# EasyEDA Pro project ProPrj_acoustic imager_2026-03-04.epro

# Schematic Schematic1
Board Name: Board1; Create Date: 2026-03-03; Page Name: P1; Project Name: acoustic imager; Schematic Name: Schematic1; Update Date: 2026-03-03; Company: EasyEDA.com; Page Size: A4; Version: V1.0
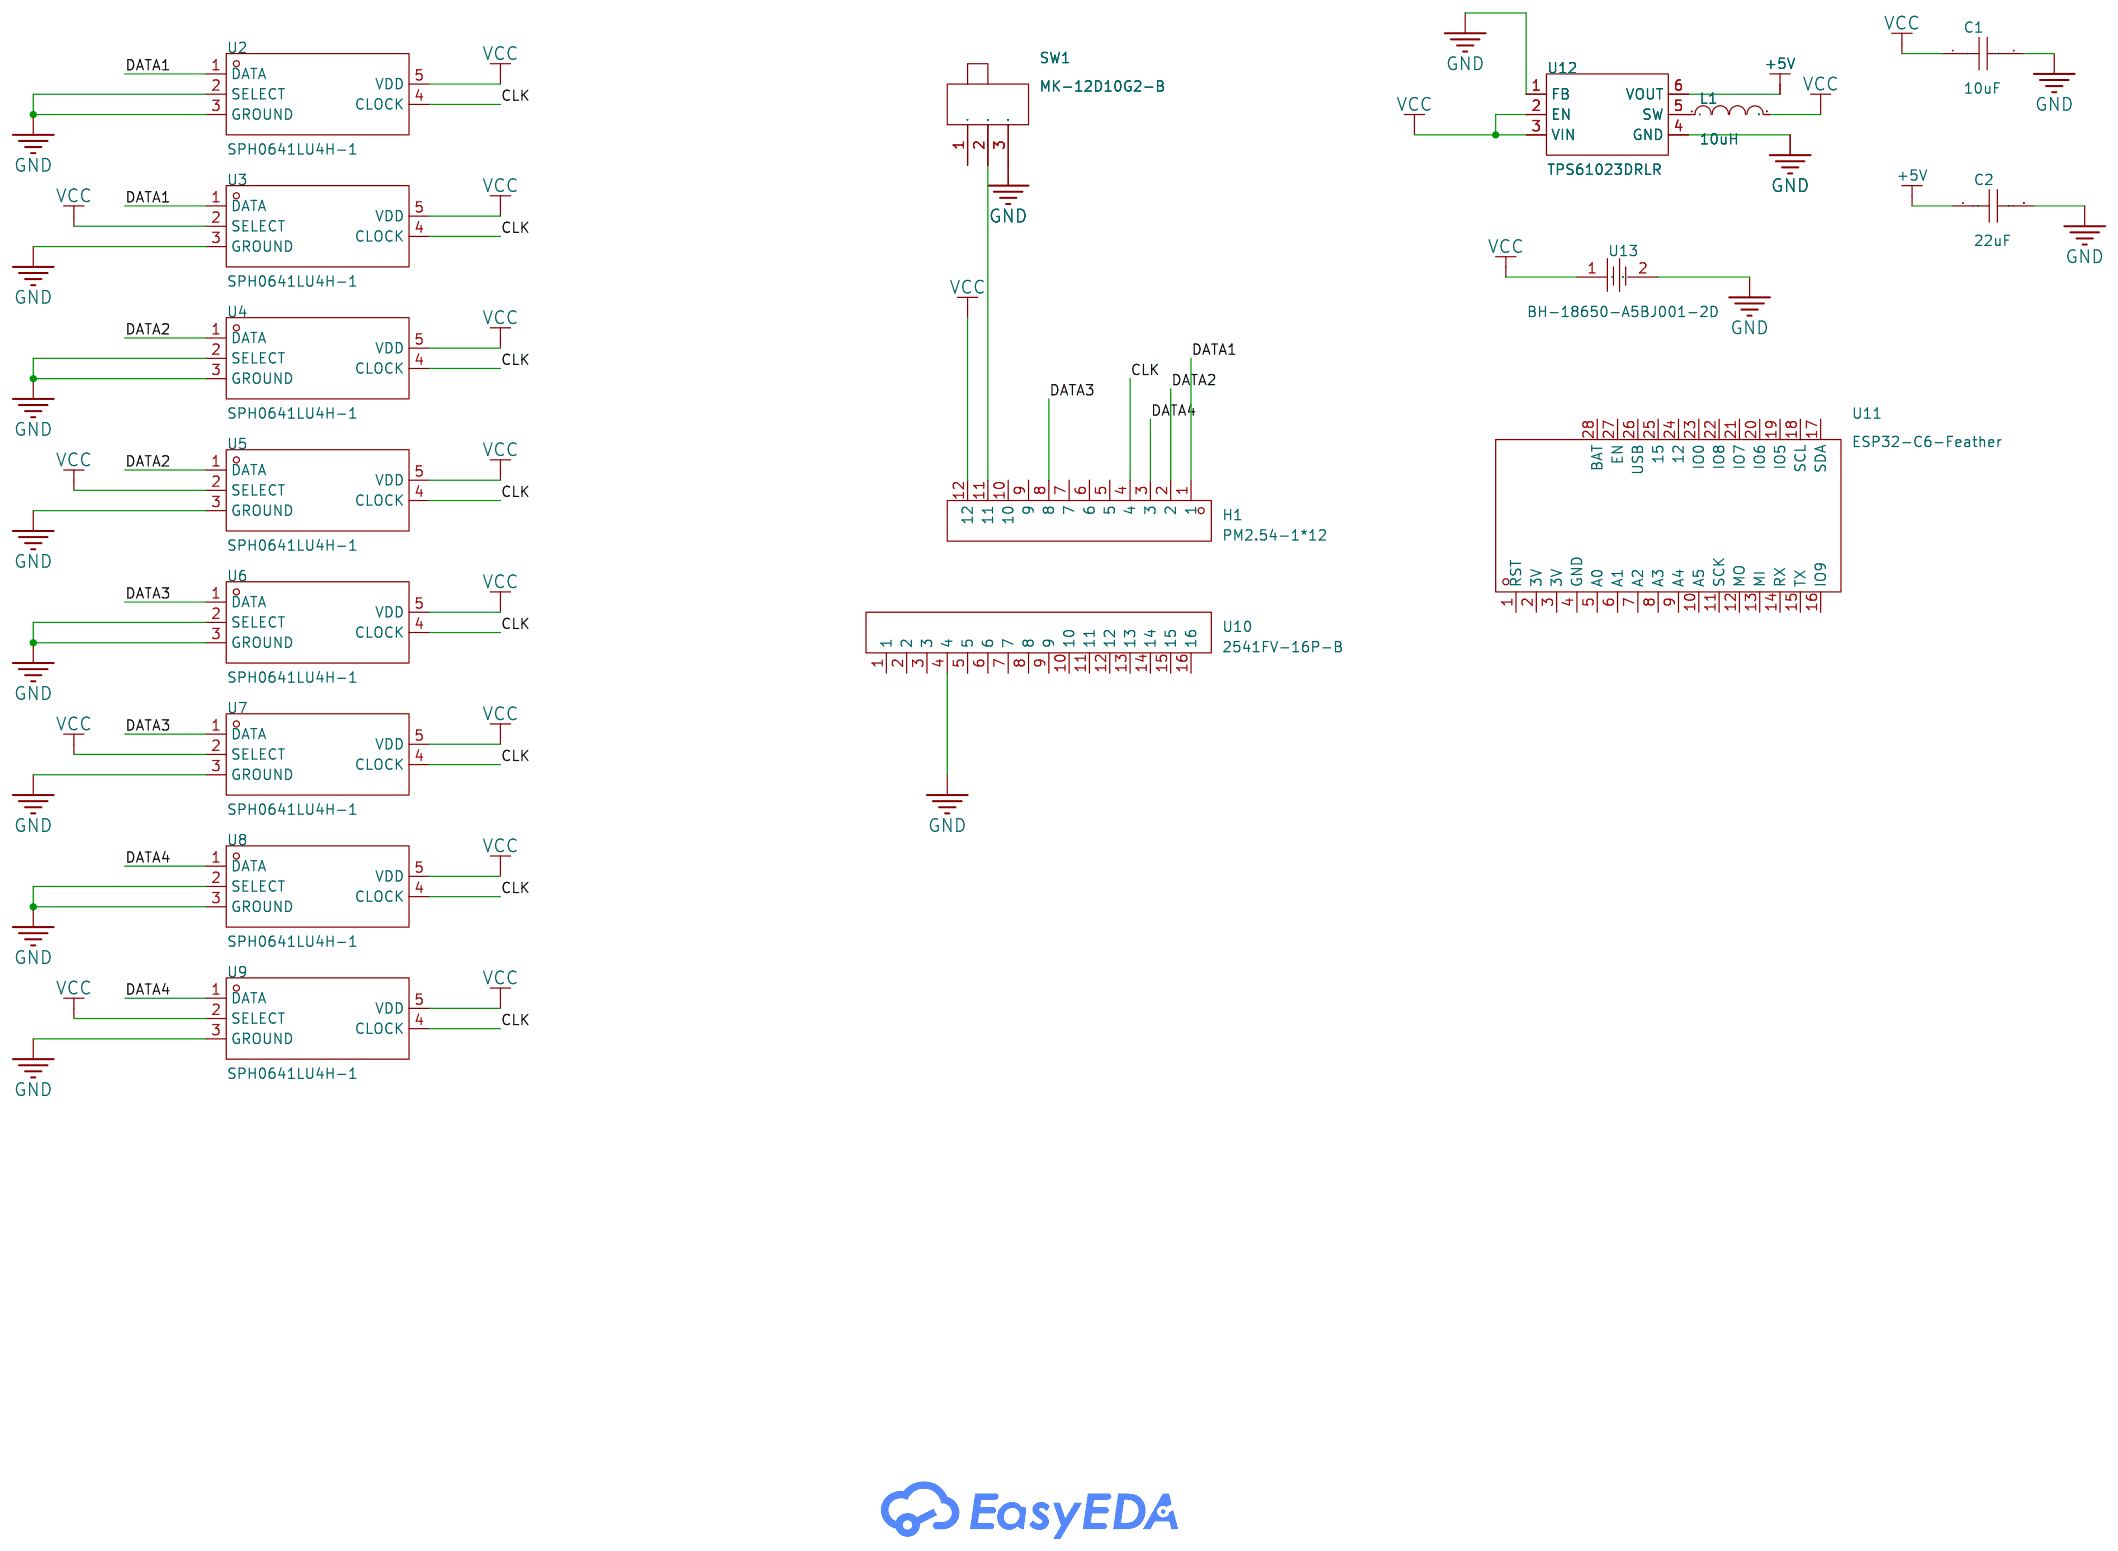
[diagram p0: schematic sheet]

## Parts
C1  10uF  [C0805]
C2  22uF  [C0805]
H1  PM2.54-1*12  [HDR-TH_12P-P2.54-V-F]
L1  10uH  [L0805]
SW1  MK-12D10G2-B  [SW-TH_MK-12D10G2-B]
U2  SPH0641LU4H-1  [MIC-SMD_5P_L3.5-W2.7-P0.82_SPH0641LU4H-1]
U3  SPH0641LU4H-1  [MIC-SMD_5P_L3.5-W2.7-P0.82_SPH0641LU4H-1]
U4  SPH0641LU4H-1  [MIC-SMD_5P_L3.5-W2.7-P0.82_SPH0641LU4H-1]
U5  SPH0641LU4H-1  [MIC-SMD_5P_L3.5-W2.7-P0.82_SPH0641LU4H-1]
U6  SPH0641LU4H-1  [MIC-SMD_5P_L3.5-W2.7-P0.82_SPH0641LU4H-1]
U7  SPH0641LU4H-1  [MIC-SMD_5P_L3.5-W2.7-P0.82_SPH0641LU4H-1]
U8  SPH0641LU4H-1  [MIC-SMD_5P_L3.5-W2.7-P0.82_SPH0641LU4H-1]
U9  SPH0641LU4H-1  [MIC-SMD_5P_L3.5-W2.7-P0.82_SPH0641LU4H-1]
U10  2541FV-16P-B  [HDR-TH_16P-P2.54-V-F-4]
U11  ESP32-C6-Feather  [COMM-TH_L50.8-W22.9-P2.54-LS20.32]
U12  TPS61023DRLR  [SOT-563_L1.6-W1.2-P0.50-LS1.6-BR]
U13  BH-18650-A5BJ001-2D  [BAT-TH_BH-18650-A5BJ001-2D]

## Library data of the parts
C1 = GRM21BR61H106KE43L: Capacitance:10uF Tolerance:±10% Tolerance:±10% Voltage Rating:50V Temperature Coefficient:X5R; LCSC Part Name: 10uF ±10% 50V; Supplier Part: C440198; Manufacturer: muRata(村田); Supplier Footprint: 0805; JLCPCB Part Class: Basic Part; Datasheet: https://item.szlcsc.com/datasheet/GRM21BR61H106KE43L/439567.html; Supplier: LCSC; Tolerance: ±10%; Voltage Rating: 50V; Temperature Coefficient: X5R
C2 = GRM21BZ71A226ME15K: Capacitance:22uF Tolerance:±20% Tolerance:±20% Voltage Rating:10V Temperature Coefficient:X7R; LCSC Part Name: 22uF ±20% 10V; Supplier Part: C22269426; Manufacturer: muRata(村田); Datasheet: https://item.szlcsc.com/datasheet/GRM21BZ71A226ME15K/23701406.html; Supplier: LCSC; Tolerance: ±20%; Voltage Rating: 10V; Temperature Coefficient: X7R
H1 = PM2.54-1*12: Holes Structure:1x12P Pitch:2.54mm Row Spacing:2.54mm Circular Hole / Square Hole:Square Hole Mounting Type:Through Hole Number of Rows:1 Number of Positions:12P Current Rating:2.5A Holes Direction:Top Insulation Height:8.5mm Operating Temperature:-40℃~+1; LCSC Part Name: 间距:2.54mm 1x12P 直插; Supplier Part: C5224029; Manufacturer: ZHOURI(洲日); Supplier Footprint: 插件,P=2.54mm; JLCPCB Part Class: Extended Part; Datasheet: https://item.szlcsc.com/datasheet/PM2.54-1*12/5925208.html; Supplier: LCSC; Holes Structure: 1x12P; Pitch: 2.54mm; Row Spacing: 2.54mm; Circular Hole / Square Hole: Square Hole; Mounting Type: Through Hole; Number of Rows: 1; Number of Positions: 12P; Current Rating: 2.5A; Holes Direction: Top; Insulation Height: 8.5mm; Operating Temperature: -40℃~+105℃
L1 = SDFL2012S100KTF: Inductance: Tolerance:±10% Tolerance:±10% Rated Current: Current - Saturation (Isat):- DC Resistance(DCR): Q @ Frequency:- Frequency - Self Resonant:- Ratings:; LCSC Part Name: 10uH ±10%; Supplier Part: C1046; Manufacturer: Sunlord(顺络); Supplier Footprint: 0805; JLCPCB Part Class: Basic Part; Datasheet: https://atta.szlcsc.com/upload/public/pdf/source/20231027/097A17DDB71564CE812E62F0F80142C9.pdf; Supplier: LCSC; Tolerance: ±10%
SW1 = MK-12D10G2-B: Circuit:SPDT Actuator Style:Rectangular Columnar Termination Style:PC Pin Length:9mm Width:3.5mm Mounting Type:Right Angle Current Rating:300mA Voltage Rating:12V Life:10,000 Cycles; LCSC Part Name: mini拨动开关; Supplier Part: C20611665; Manufacturer: HOOYA(皓宇电子); Supplier Footprint: 插件,9x3.5mm; JLCPCB Part Class: Extended Part; Datasheet: https://item.szlcsc.com/datasheet/MK-12D10G2-B/21966512.html; Supplier: LCSC; Circuit: SPDT; Actuator Style: Rectangular Columnar; Termination Style: PC Pin; Length: 9mm; Width: 3.5mm; Mounting Type: Right Angle; Current Rating: 300mA; Voltage Rating: 12V; Life: 10,000 Cycles
U2-U9 = SPH0641LU4H-1: Direction:Omnidirectional Voltage - Supply:1.8V Voltage - Supply:1.8V Current Consumption:235uA~270uA Current Consumption:235uA~270uA S/N Ratio:64.3dB Sensitivity:-26dB Sensitivity:-26dB Length:3.5mm Width:2.65mm Height:0.98mm; LCSC Part Name: 1.8V -26dB; Supplier Part: C2879853; Manufacturer: Knowles(楼氏); JLCPCB Part Class: Extended Part; Datasheet: https://item.szlcsc.com/datasheet/SPH0641LU4H-1/3089079.html; Supplier: LCSC; Direction: Omnidirectional; Voltage - Supply: 1.8V; Current Consumption: 235uA~270uA; S/N Ratio: 64.3dB; Sensitivity: -26dB; Length: 3.5mm; Width: 2.65mm; Height: 0.98mm
U10 = 2541FV-16P-B: Holes Structure:1x16P Pitch:2.54mm Row Spacing:2.54mm Circular Hole / Square Hole:Square Hole Mounting Type:Through Hole Number of Rows:1 Number of Positions:16P Current Rating:3A Voltage Rating (Max):- Holes Direction:Top Insulation Height:- Contact Mate; LCSC Part Name: 1x16P 间距:2.54mm 直插; Supplier Part: C25503122; Manufacturer: HanElectricity(瀚源); Supplier Footprint: 插件,P=2.54mm; Datasheet: https://item.szlcsc.com/datasheet/2541FV-16P-B/27233665.html; Supplier: LCSC; Holes Structure: 1x16P; Pitch: 2.54mm; Row Spacing: 2.54mm; Circular Hole / Square Hole: Square Hole; Mounting Type: Through Hole; Number of Rows: 1; Number of Positions: 16P; Current Rating: 3A; Holes Direction: Top; Operating Temperature: -40℃~+105℃
U11 = ESP32-C6-Feather: Supplier Part: C9900163338; Supplier Footprint: 插件; Supplier: LCSC
U12 = TPS61023DRLR: Function:Boost type Output Type:Adjustable Voltage - Supply:500mV~5.5V Voltage - Supply:500mV~5.5V Output Voltage:2.2V~5.5V Output Voltage:2.2V~5.5V Output Current:3A Frequency - Switching:1MHz Frequency - Switching:1MHz Operating Temperature:-40℃~+125℃@(; Supplier Part: C919459; Manufacturer: TI(德州仪器); Supplier Footprint: SOT-563; JLCPCB Part Class: Extended Part; Datasheet: https://www.ti.com.cn/cn/lit/ds/symlink/tps61023.pdf?ts=1728812468331&ref_url=https%253A%252F%252Fwww.ti.com.cn%252Fproduct%252Fcn%252FTPS61023; Supplier: LCSC; Function: Boost type; Output Type: Adjustable; Voltage - Supply: 500mV~5.5V; Output Voltage: 2.2V~5.5V; Output Current: 3A; Frequency - Switching: 1MHz; Operating Temperature: -40℃~+125℃@(TJ); Synchronous Rectifier: Yes; Number of Outputs: 1; Topology: Boost; Switch tube (built-in/external): Built-in
U13 = BH-18650-A5BJ001-2D: Type:Battery holder Operating Temperature:-10~100℃ Contact coating:Nickel plated; LCSC Part Name: MYOUNG(美阳)电池盒BH-18650-1J Ni 卧式DIP 二代 适配18650电池; Supplier Part: C19184083; Manufacturer: MYOUNG(美阳); JLCPCB Part Class: Extended Part; Datasheet: https://item.szlcsc.com/datasheet/BH-18650-A5BJ001-2D/20398489.html; Supplier: LCSC; Type: Battery holder; Operating Temperature: -10~100℃; Contact coating: Nickel plated

## Nets
+5V: C2.1 U12.6(VOUT)
GND: C1.2 C2.2 SW1.3 U2.2(SELECT) U2.3(GROUND) U3.3(GROUND) U4.2(SELECT) U4.3(GROUND) U5.3(GROUND) U6.2(SELECT) U6.3(GROUND) U7.3(GROUND) U8.2(SELECT) U8.3(GROUND) U9.3(GROUND) U10.4 U12.1(FB) U12.4(GND) U13.2
VCC: C1.1 H1.12 L1.2 U2.5(VDD) U3.2(SELECT) U3.5(VDD) U4.5(VDD) U5.2(SELECT) U5.5(VDD) U6.5(VDD) U7.2(SELECT) U7.5(VDD) U8.5(VDD) U9.2(SELECT) U9.5(VDD) U12.2(EN) U12.3(VIN) U13.1
CLK: H1.4 U2.4(CLOCK) U3.4(CLOCK) U4.4(CLOCK) U5.4(CLOCK) U6.4(CLOCK) U7.4(CLOCK) U8.4(CLOCK) U9.4(CLOCK)
DATA1: H1.1 U2.1(DATA) U3.1(DATA)
DATA2: H1.2 U4.1(DATA) U5.1(DATA)
DATA3: H1.8 U6.1(DATA) U7.1(DATA)
DATA4: H1.3 U8.1(DATA) U9.1(DATA)
Net-(H1-11): H1.11 SW1.2
Net-(L1-1): L1.1 U12.5(SW)

Not connected (* = marked no-connect by the designer): H1 5 6 7 9 10; SW1 1; U10 1 2 3 5 6 7 8 9 10 11 12 13 14 15 16; U11 1(RST) 2(3V) 3(3V) 4(GND) 5(A0) 6(A1) 7(A2) 8(A3) 9(A4) 10(A5) 11(SCK) 12(MO) 13(MI) 14(RX) 15(TX) 16(IO9) 17(SDA) 18(SCL) 19(IO5) 20(IO6) 21(IO7) 22(IO8) 23(IO0) 24(12) 25(15) 26(USB) 27(EN) 28(BAT)

# Board PCB1
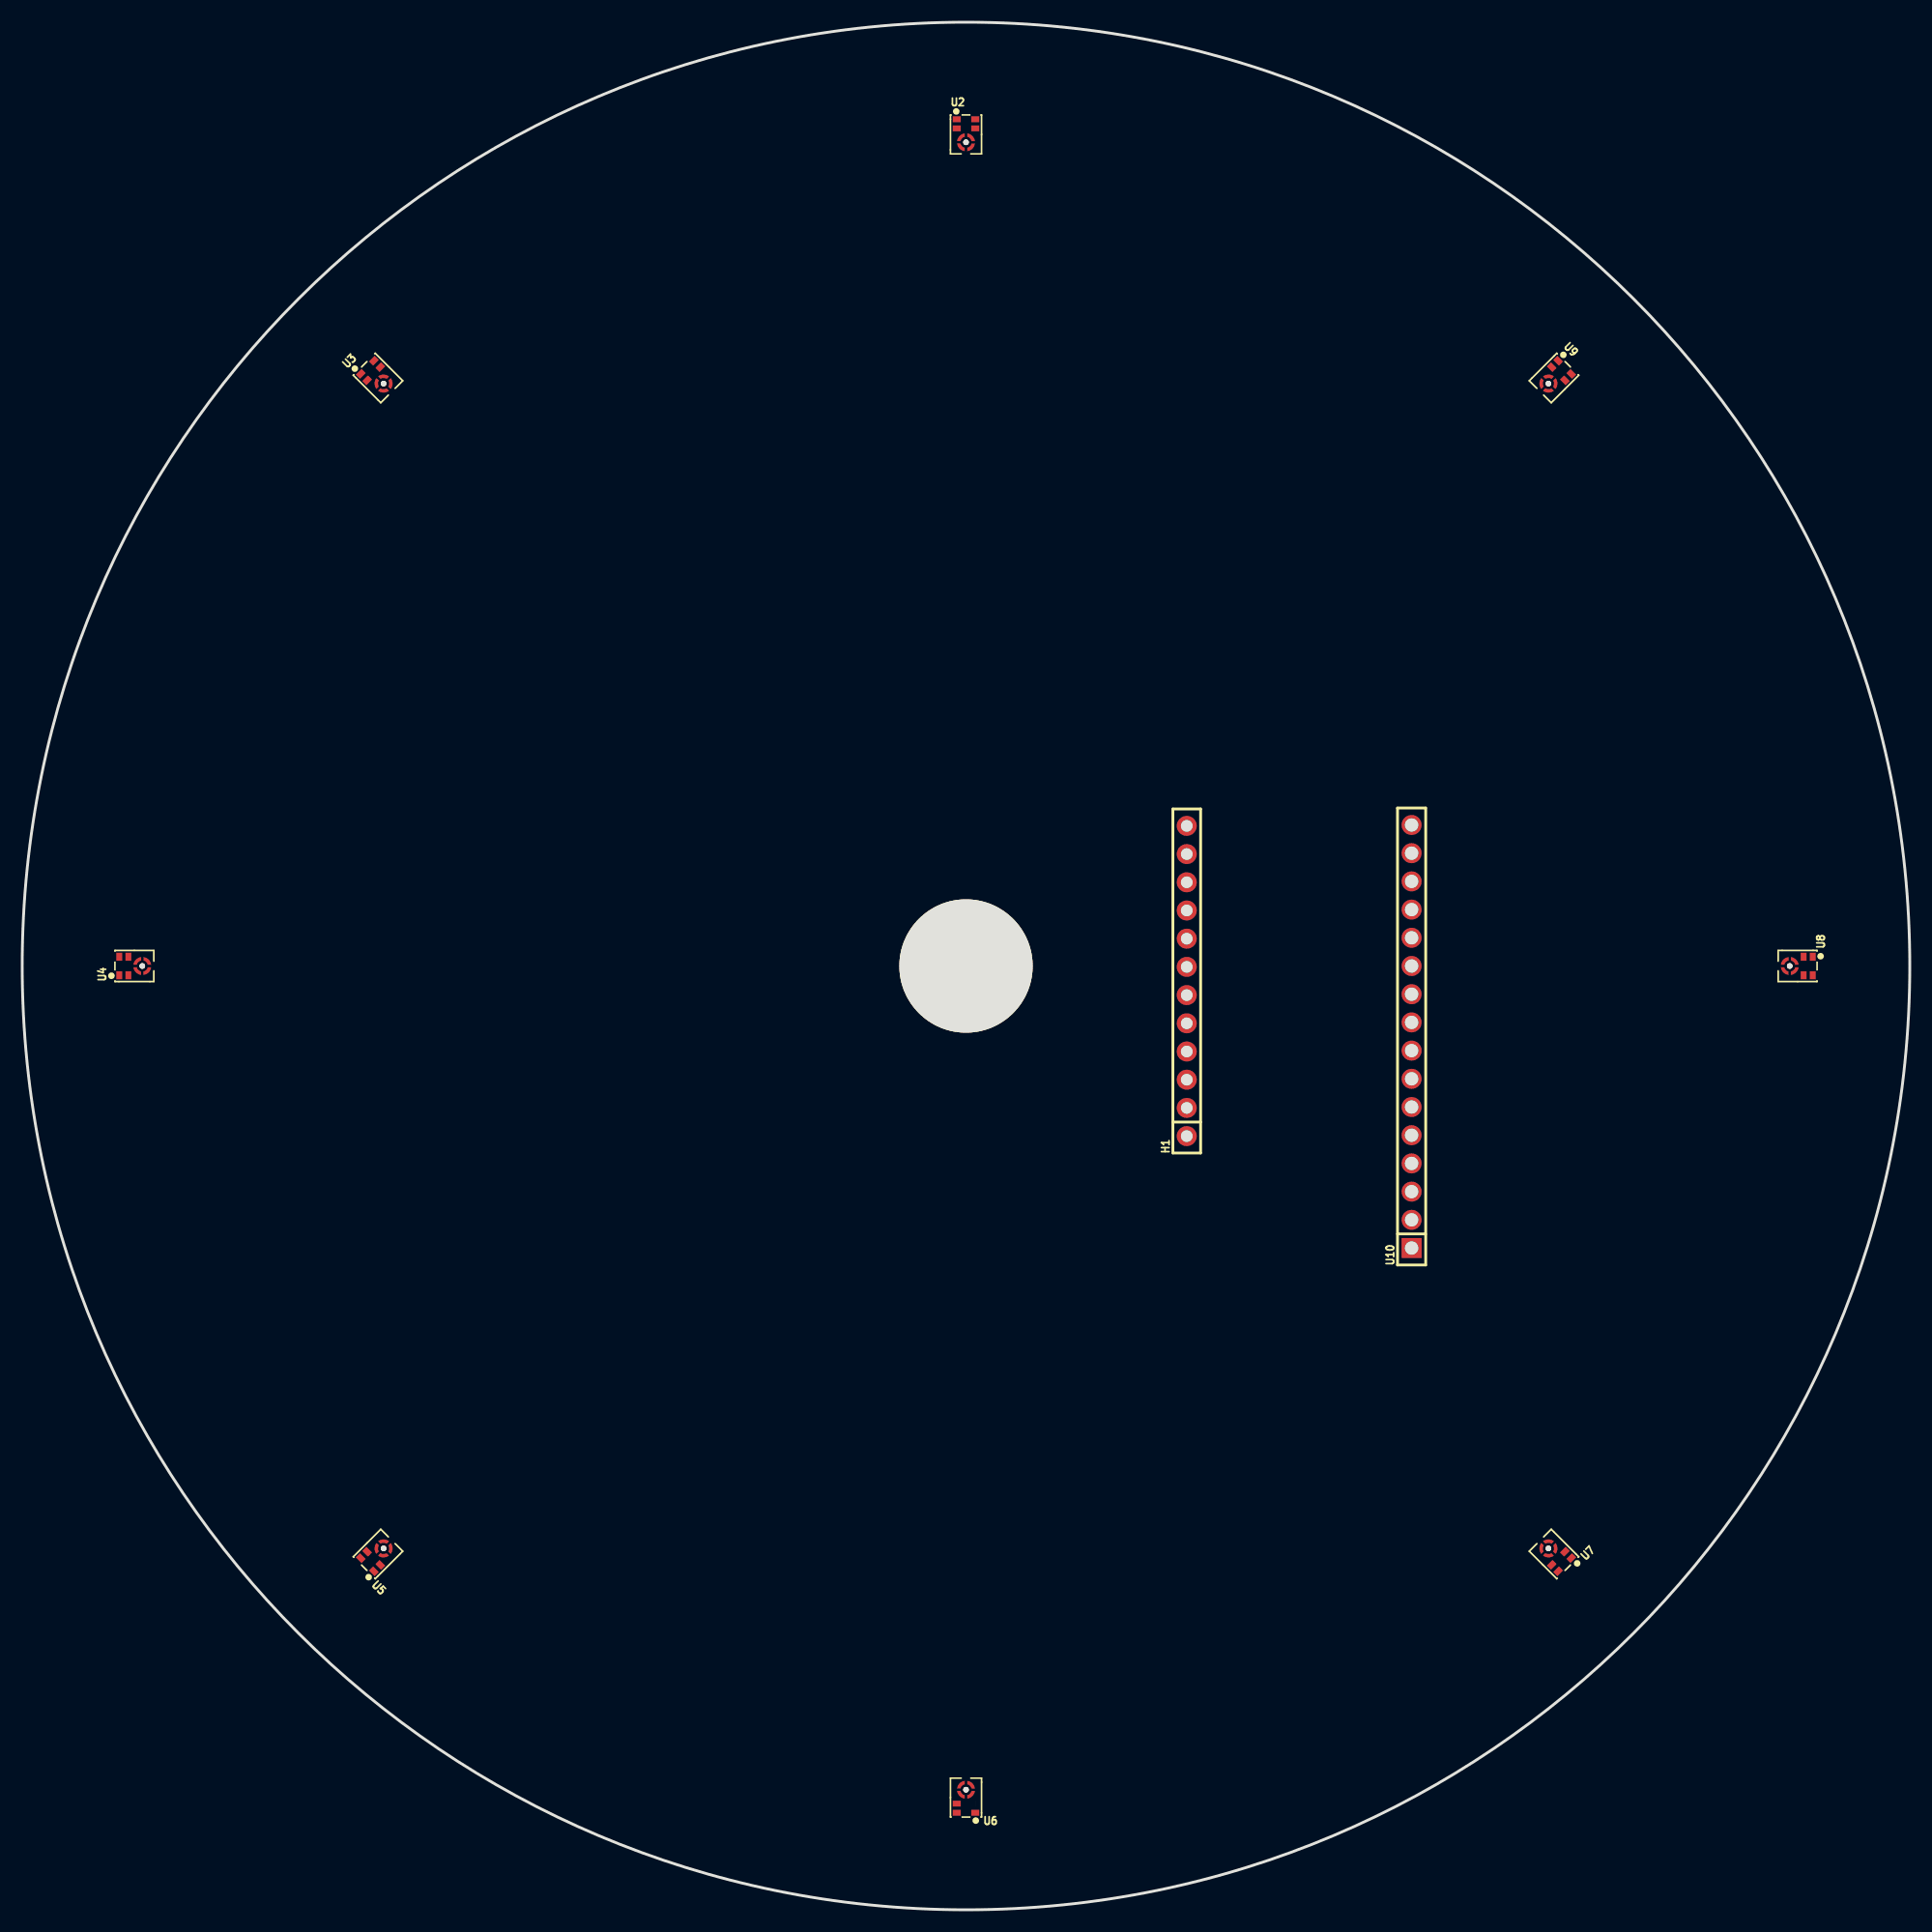
[diagram p1: board, top side]
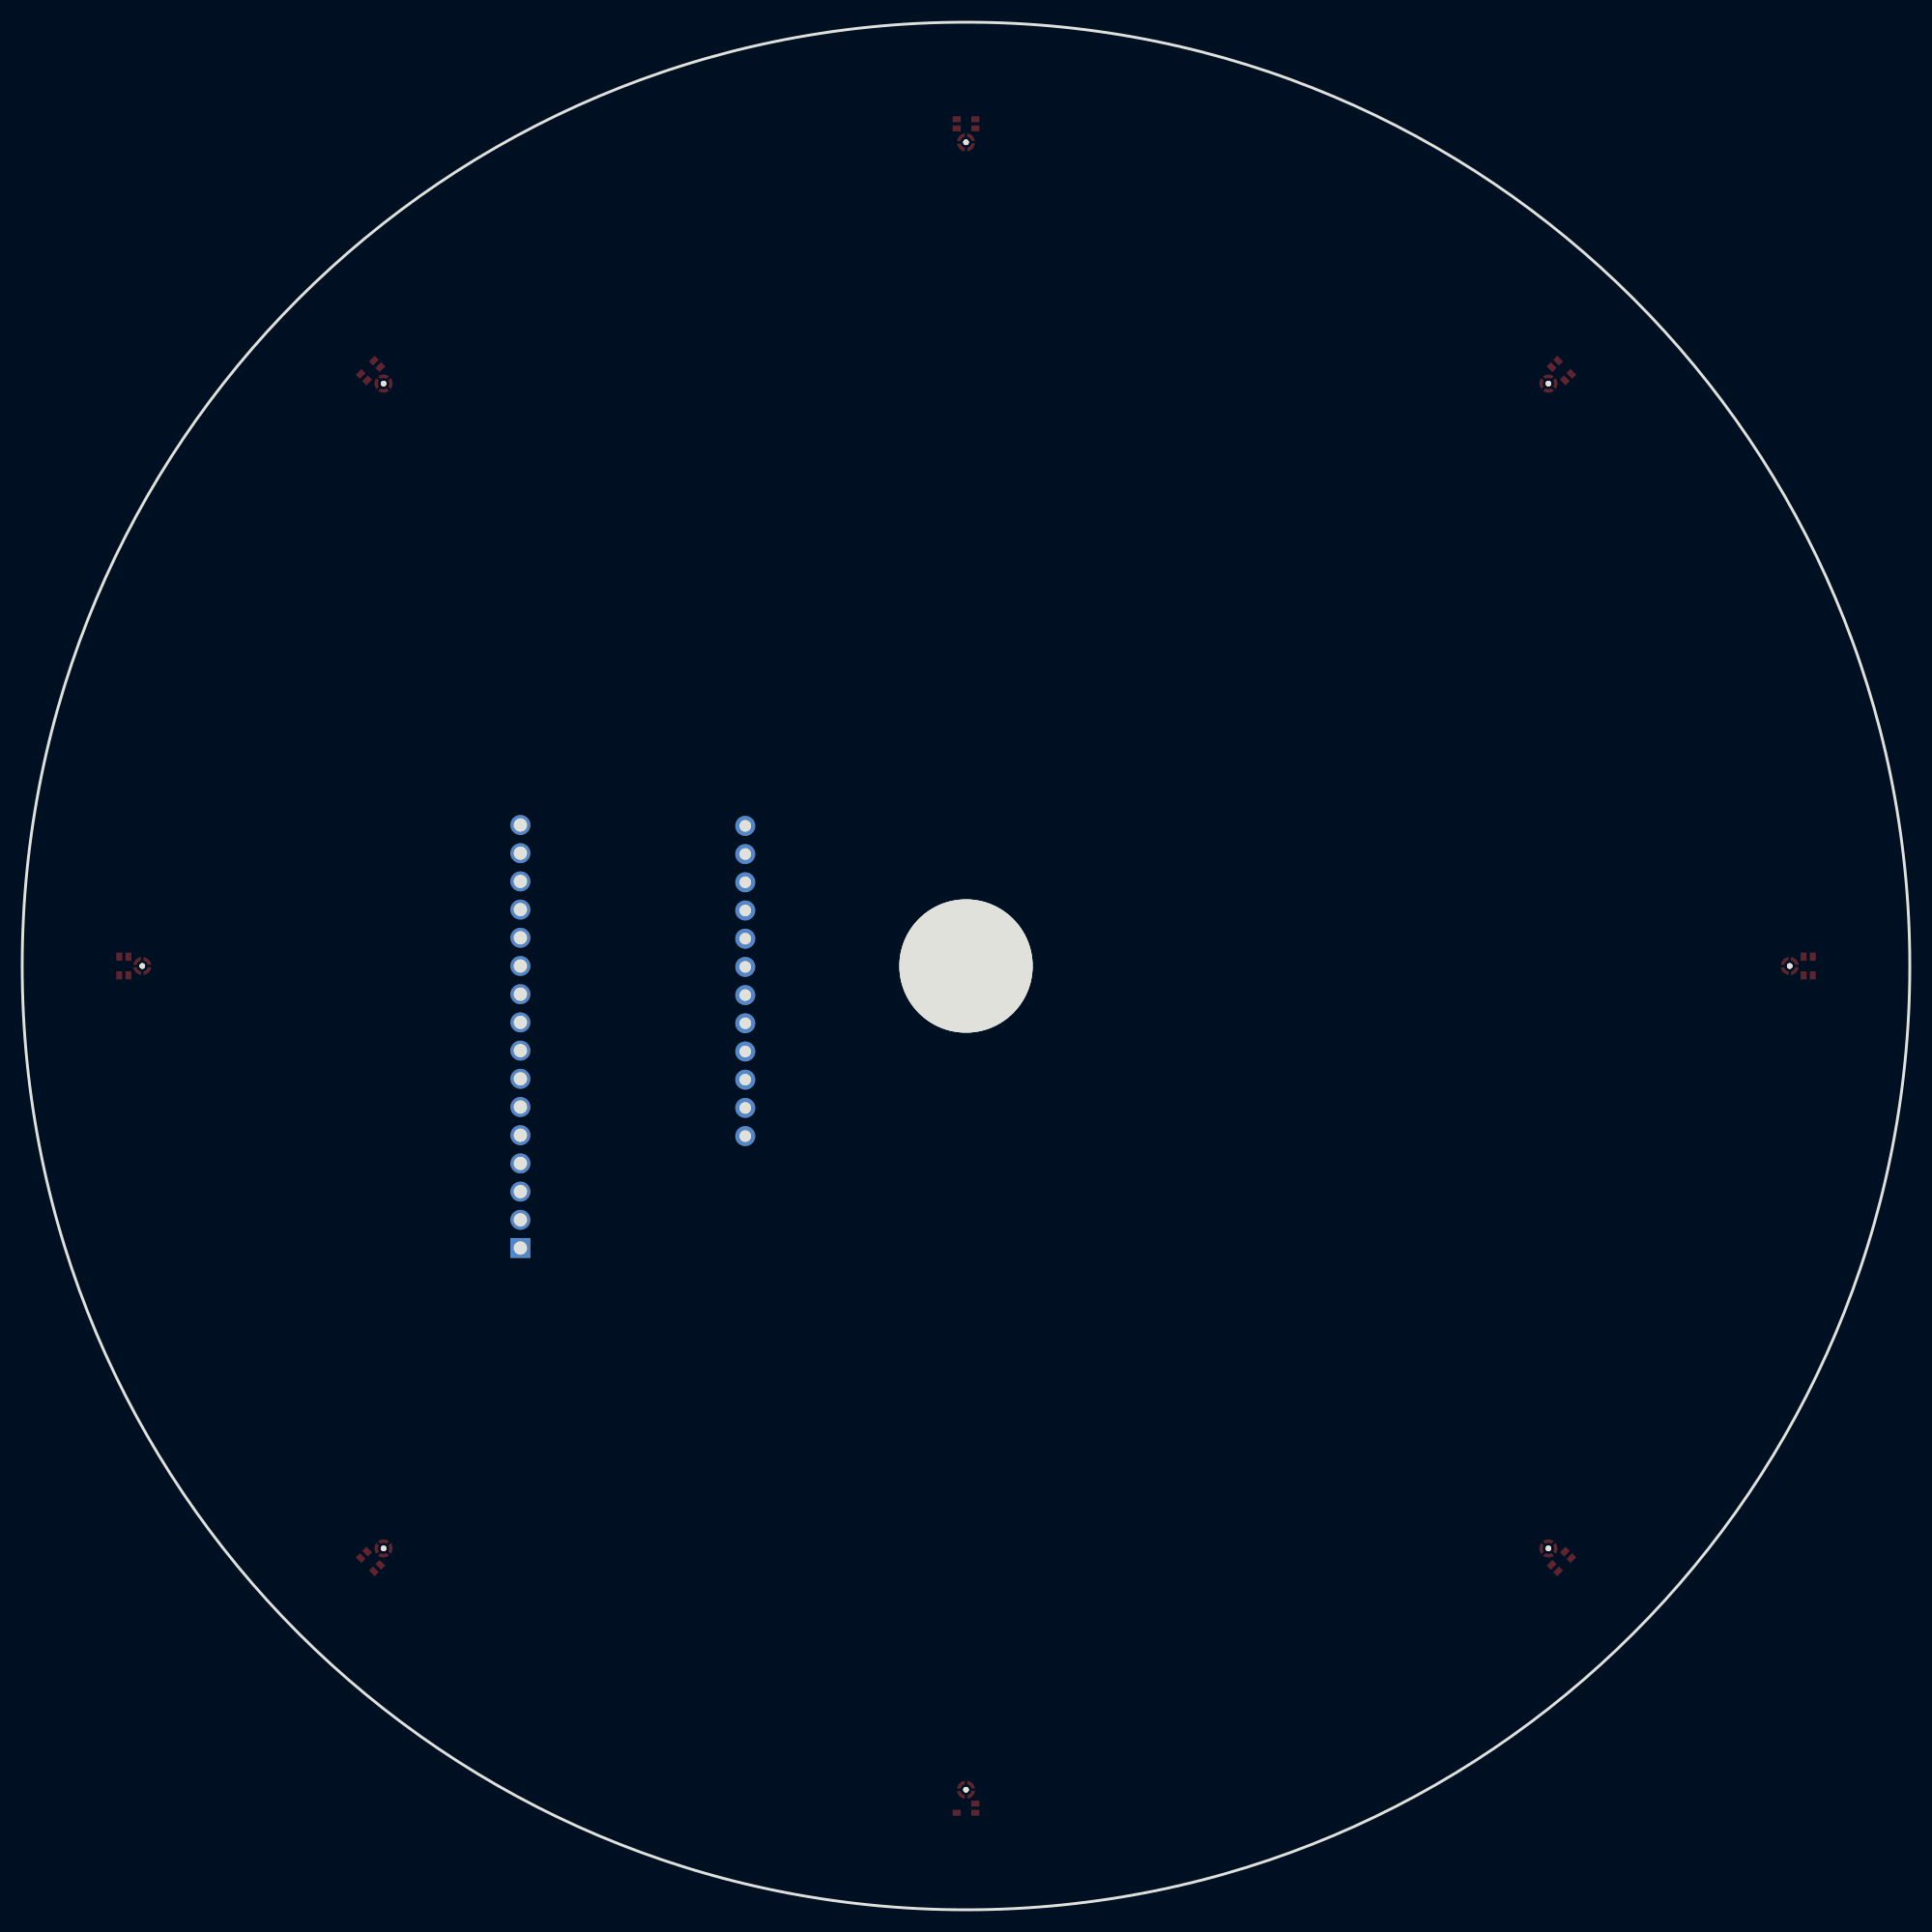
[diagram p2: board, bottom side, seen from below]

Outline 170 x 170 mm; copper layers: Top Layer, Bottom Layer. Coordinates in mm from the lower left corner of the outline.
Outline path: circle c85,85 r85
Stack: Top Layer 0.035mm / Dielectric1 1.51mm FR4 er 4.5 / Bottom Layer 0.035mm

## Design rules (mm)
template: JLCPCB Capability(Two Layers Board)
spacing copperThickness1oz (default): track to track 0.102, other pairs 0.152 to 0.3
spacing copperThickness2oz: track to track 0.203, other pairs 0.152 to 0.3
track width copperThickness1oz (default): min 0.127, default 0.254, max 2.54
track width copperThickness2oz: min 0.203, default 0.254, max 2.54
differential pair differentialPair (default): width min 0.127, default 0.254, max 2.54; gap min 0.152, default 0.152
via viaSize (default): diameter min 0.5, default 0.61, max 10; hole min 0.3, default 0.305, max 6.3

## Placement (name value [footprint] x y rotation side)
H1  PM2.54-1*12  [HDR-TH_12P-P2.54-V-F]  104.88 83.65 90 top
NOREF  -  [Pad_e30]  159.19 85 0 top
NOREF#2  -  [Pad_e42]  85 85 0 top
NOREF#3  -  [Pad_e24]  32.55 32.55 0 top
NOREF#4  -  [Pad_e29]  137.45 32.55 0 top
NOREF#5  -  [Pad_e22]  10.81 85 0 top
NOREF#6  -  [Pad_e18]  85 159.19 0 top
NOREF#7  -  [Pad_e26]  85 10.81 0 top
NOREF#8  -  [Pad_e20]  32.55 137.45 0 top
NOREF#9  -  [Pad_e31]  137.45 137.45 0 top
U2  SPH0641LU4H-1  [MIC-SMD_5P_L3.5-W2.7-P0.82_SPH0641LU4H-1]  85 160 0 top
U3  SPH0641LU4H-1  [MIC-SMD_5P_L3.5-W2.7-P0.82_SPH0641LU4H-1]  31.97 138.03 45 top
U4  SPH0641LU4H-1  [MIC-SMD_5P_L3.5-W2.7-P0.82_SPH0641LU4H-1]  10 85 90 top
U5  SPH0641LU4H-1  [MIC-SMD_5P_L3.5-W2.7-P0.82_SPH0641LU4H-1]  31.97 31.97 135 top
U6  SPH0641LU4H-1  [MIC-SMD_5P_L3.5-W2.7-P0.82_SPH0641LU4H-1#2]  85 10 180 top
U7  SPH0641LU4H-1  [MIC-SMD_5P_L3.5-W2.7-P0.82_SPH0641LU4H-1]  138.03 31.97 225 top
U8  SPH0641LU4H-1  [MIC-SMD_5P_L3.5-W2.7-P0.82_SPH0641LU4H-1]  160 85 270 top
U9  SPH0641LU4H-1  [MIC-SMD_5P_L3.5-W2.7-P0.82_SPH0641LU4H-1]  138.03 138.03 315 top
U10  2541FV-16P-B  [HDR-TH_16P-P2.54-V-F-4]  125.13 78.65 90 top

## Footprints (pads in the part's own frame, mm; a bottom-side part is the same pattern mirrored in y, then rotated)
HDR-TH_12P-P2.54-V-F
  round 1.8 hole 1.05: 1(-13.97,0) 2(-11.43,0) 3(-8.89,0) 4(-6.35,0) 5(-3.81,0) 6(-1.27,0) 7(1.27,0) 8(3.81,0) 9(6.35,0) 10(8.89,0) 11(11.43,0) 12(13.97,0)
HDR-TH_16P-P2.54-V-F-4
  rect 1.8x1.8 hole 1.2: 1(-19.05,0)
  round 1.8 hole 1.2: 2(-16.51,0) 3(-13.97,0) 4(-11.43,0) 5(-8.89,0) 6(-6.35,0) 7(-3.81,0) 8(-1.27,0) 9(1.27,0) 10(3.81,0) 11(6.35,0) 12(8.89,0) 13(11.43,0) 14(13.97,0) 15(16.51,0) 16(19.05,0)
MIC-SMD_5P_L3.5-W2.7-P0.82_SPH0641LU4H-1
  rect 0.73x0.53 smd: 1(-0.838,1.26) 2(-0.838,0.438) 4(0.838,0.438) 5(0.838,1.26)
  custom 0.696x0.705 smd: 3(-0.459,-1.25) 3(0.459,-0.379)
  custom 0.704x0.696 smd: 3(-0.453,-0.369) 3(0.453,-1.26)
MIC-SMD_5P_L3.5-W2.7-P0.82_SPH0641LU4H-1#2
  rect 0.73x0.53 smd: 1(-0.838,1.26) 4(0.838,0.438) 5(0.838,1.26)
  rect 0.003x0.53 smd: 2(-0.838,0.438)
  custom 0.696x0.705 smd: 3(-0.459,-1.25) 3(0.459,-0.379)
  custom 0.704x0.696 smd: 3(-0.453,-0.369) 3(0.453,-1.26)
Pad_e18
  round 0.5 hole 0.5: 1(0,0)
Pad_e20
  round 0.5 hole 0.5: 1(0,0)
Pad_e22
  round 0.5 hole 0.5: 1(0,0)
Pad_e24
  round 0.5 hole 0.5: 1(0,0)
Pad_e26
  round 0.5 hole 0.5: 1(0,0)
Pad_e29
  round 0.5 hole 0.5: 1(0,0)
Pad_e30
  round 0.5 hole 0.5: 2(0,0)
Pad_e31
  round 0.5 hole 0.5: 3(0,0)
Pad_e42
  round 12 hole 12: 1(0,0)

## Nets
As in the schematic, except:
VCC: U2.5 U3.2 U3.5 U4.5 U5.2 U5.5 U6.5 U7.2 U7.5 U8.5 U9.2 U9.5

Pads without a net: H1 5 6 7 9 10 11 12; NOREF 2; NOREF#2 1; NOREF#3 1; NOREF#4 1; NOREF#5 1; NOREF#6 1; NOREF#7 1; NOREF#8 1; NOREF#9 3; U10 1 2 3 5 6 7 8 9 10 11 12 13 14 15 16
